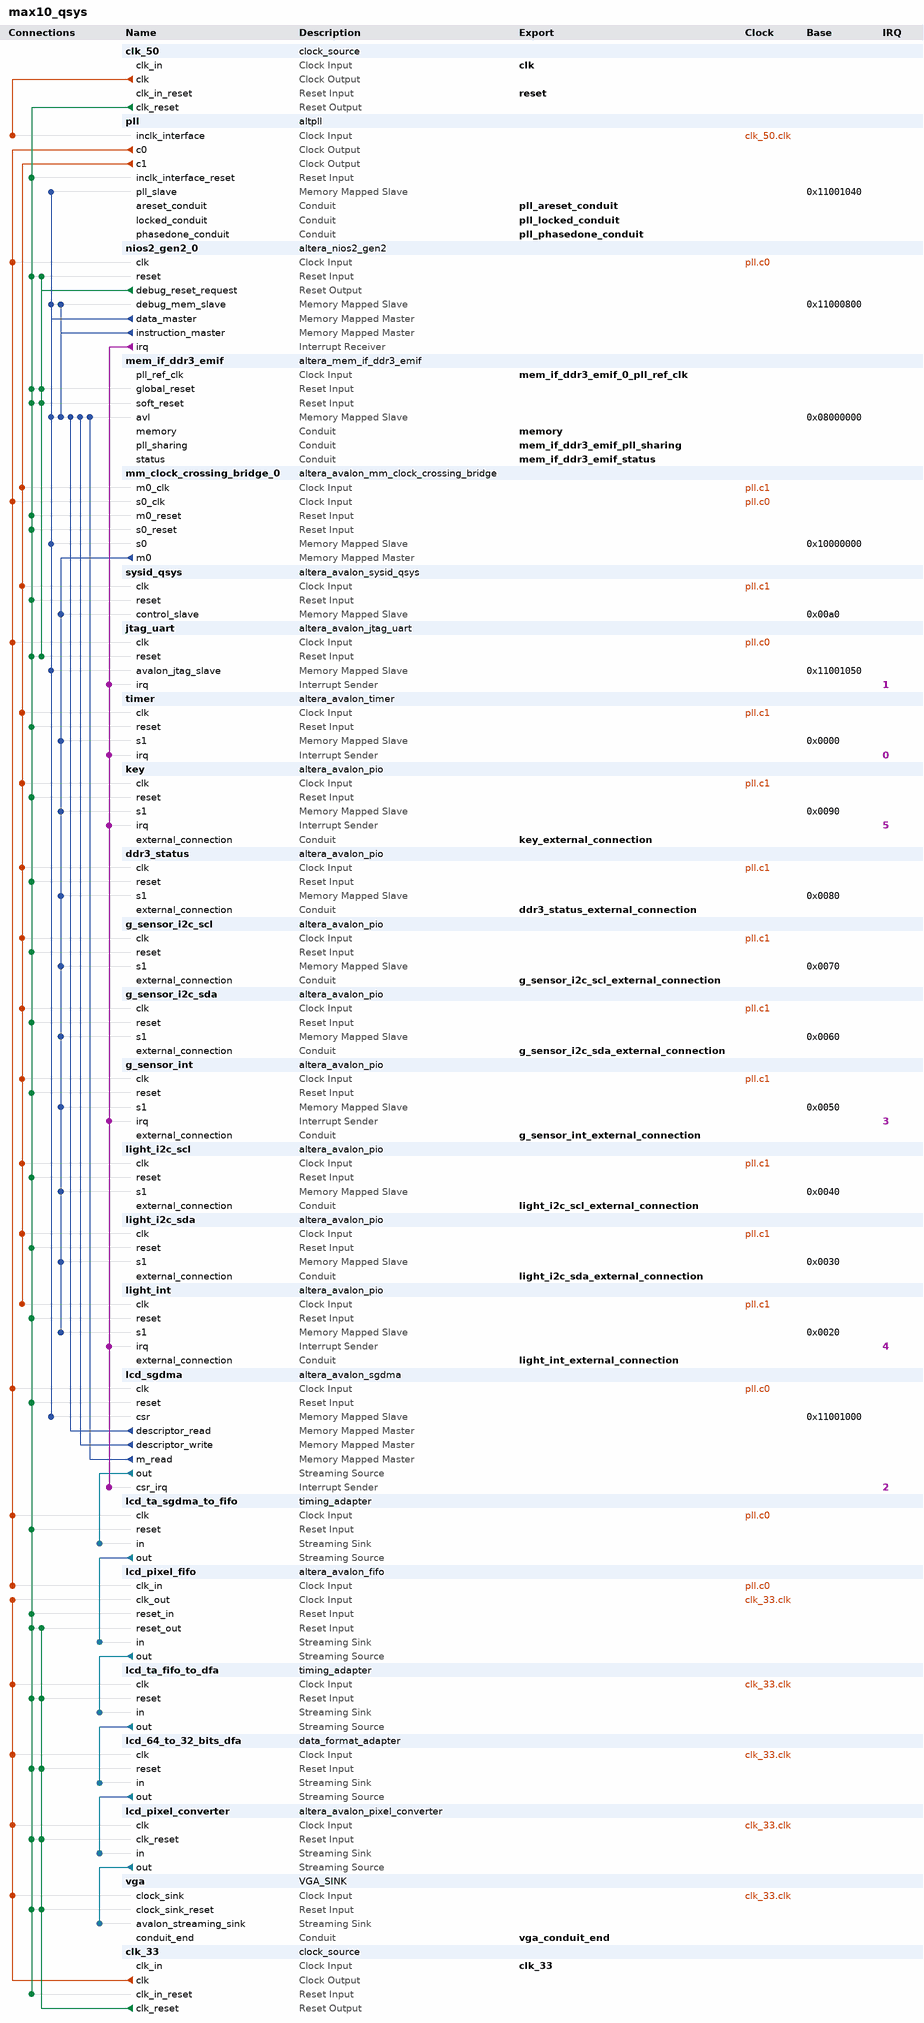
[diagram p0: system contents]
# Platform Designer (Qsys) system max10_qsys, MAX 10 10M50DAF484C6GES
# Parameters at their usual value, and those the tool derives, are not listed.
package require -exact qsys 15.0
create_system max10_qsys
set_project_property DEVICE_FAMILY {MAX 10}
set_project_property DEVICE 10M50DAF484C6GES

add_instance clk_50 clock_source 15.0
set_instance_parameter_value clk_50 clockFrequency 50000000

add_instance pll altpll 15.0
set_instance_parameter_value pll CLK0_DIVIDE_BY 1
set_instance_parameter_value pll CLK0_MULTIPLY_BY 2
set_instance_parameter_value pll CLK1_DIVIDE_BY 5
set_instance_parameter_value pll CLK1_DUTY_CYCLE 50
set_instance_parameter_value pll CLK1_MULTIPLY_BY 4
set_instance_parameter_value pll CLK1_PHASE_SHIFT 0
set_instance_parameter_value pll INCLK0_INPUT_FREQUENCY 20000
set_instance_parameter_value pll PORT_ARESET PORT_USED
set_instance_parameter_value pll PORT_LOCKED PORT_USED
set_instance_parameter_value pll PORT_clk1 PORT_USED
set_instance_parameter_value pll PORT_clk2 PORT_UNUSED
set_instance_parameter_value pll PORT_clk3 PORT_UNUSED

add_instance nios2_gen2_0 altera_nios2_gen2 15.0
set_instance_parameter_value nios2_gen2_0 dcache_size 2048
set_instance_parameter_value nios2_gen2_0 exceptionSlave mem_if_ddr3_emif.avl
set_instance_parameter_value nios2_gen2_0 icache_size 4096
set_instance_parameter_value nios2_gen2_0 impl Fast
set_instance_parameter_value nios2_gen2_0 resetSlave mem_if_ddr3_emif.avl

add_instance mem_if_ddr3_emif altera_mem_if_ddr3_emif 15.0
set_instance_parameter_value mem_if_ddr3_emif AVL_MAX_SIZE 4
set_instance_parameter_value mem_if_ddr3_emif CALIBRATION_MODE Skip
set_instance_parameter_value mem_if_ddr3_emif CPORT_TYPE_PORT Bidirectional,Bidirectional,Bidirectional,Bidirectional,Bidirectional,Bidirectional
set_instance_parameter_value mem_if_ddr3_emif EXPORT_AFI_HALF_CLK false
set_instance_parameter_value mem_if_ddr3_emif HARD_EMIF false
set_instance_parameter_value mem_if_ddr3_emif MEM_BANKADDR_WIDTH 3
set_instance_parameter_value mem_if_ddr3_emif MEM_CLK_FREQ 300.0
set_instance_parameter_value mem_if_ddr3_emif MEM_CLK_FREQ_MAX 800.0
set_instance_parameter_value mem_if_ddr3_emif MEM_COL_ADDR_WIDTH 10
set_instance_parameter_value mem_if_ddr3_emif MEM_DQ_WIDTH 24
set_instance_parameter_value mem_if_ddr3_emif MEM_FORMAT DISCRETE
set_instance_parameter_value mem_if_ddr3_emif MEM_ROW_ADDR_WIDTH 13
set_instance_parameter_value mem_if_ddr3_emif MEM_TCL 7
set_instance_parameter_value mem_if_ddr3_emif MEM_TFAW_NS 45.0
set_instance_parameter_value mem_if_ddr3_emif MEM_TRAS_NS 35.0
set_instance_parameter_value mem_if_ddr3_emif MEM_TRCD_NS 13.75
set_instance_parameter_value mem_if_ddr3_emif MEM_TRFC_NS 260.0
set_instance_parameter_value mem_if_ddr3_emif MEM_TRP_NS 13.75
set_instance_parameter_value mem_if_ddr3_emif MEM_TRRD_NS 7.5
set_instance_parameter_value mem_if_ddr3_emif MEM_TRTP_NS 7.5
set_instance_parameter_value mem_if_ddr3_emif MEM_TWTR 6
set_instance_parameter_value mem_if_ddr3_emif MEM_VENDOR Micron
set_instance_parameter_value mem_if_ddr3_emif MEM_WTCL 6
set_instance_parameter_value mem_if_ddr3_emif PLL_LOCATION Top_Bottom
set_instance_parameter_value mem_if_ddr3_emif POWER_OF_TWO_BUS true
set_instance_parameter_value mem_if_ddr3_emif PRIORITY_PORT 1,1,1,1,1,1
set_instance_parameter_value mem_if_ddr3_emif RATE Half
set_instance_parameter_value mem_if_ddr3_emif REF_CLK_FREQ 50.0
set_instance_parameter_value mem_if_ddr3_emif SPEED_GRADE 6
set_instance_parameter_value mem_if_ddr3_emif TIMING_BOARD_AC_SKEW 0.0116
set_instance_parameter_value mem_if_ddr3_emif TIMING_BOARD_AC_TO_CK_SKEW -0.005
set_instance_parameter_value mem_if_ddr3_emif TIMING_BOARD_DQ_TO_DQS_SKEW -3.0E-4
set_instance_parameter_value mem_if_ddr3_emif TIMING_BOARD_MAX_CK_DELAY 0.314
set_instance_parameter_value mem_if_ddr3_emif TIMING_BOARD_MAX_DQS_DELAY 0.199
set_instance_parameter_value mem_if_ddr3_emif TIMING_BOARD_SKEW_BETWEEN_DQS 0.0267
set_instance_parameter_value mem_if_ddr3_emif TIMING_BOARD_SKEW_CKDQS_DIMM_MAX 0.142
set_instance_parameter_value mem_if_ddr3_emif TIMING_BOARD_SKEW_CKDQS_DIMM_MIN 0.115
set_instance_parameter_value mem_if_ddr3_emif TIMING_BOARD_SKEW_WITHIN_DQS 0.007
set_instance_parameter_value mem_if_ddr3_emif TIMING_TDH 55
set_instance_parameter_value mem_if_ddr3_emif TIMING_TDQSCK 225
set_instance_parameter_value mem_if_ddr3_emif TIMING_TDQSQ 125
set_instance_parameter_value mem_if_ddr3_emif TIMING_TDQSS 0.25
set_instance_parameter_value mem_if_ddr3_emif TIMING_TDS 55
set_instance_parameter_value mem_if_ddr3_emif TIMING_TDSH 0.2
set_instance_parameter_value mem_if_ddr3_emif TIMING_TDSS 0.2
set_instance_parameter_value mem_if_ddr3_emif TIMING_TIH 130
set_instance_parameter_value mem_if_ddr3_emif TIMING_TIS 185
set_instance_parameter_value mem_if_ddr3_emif TIMING_TQSH 0.4
set_instance_parameter_value mem_if_ddr3_emif USER_DEBUG_LEVEL 1

add_instance mm_clock_crossing_bridge_0 altera_avalon_mm_clock_crossing_bridge 15.0
set_instance_parameter_value mm_clock_crossing_bridge_0 ADDRESS_WIDTH 10
set_instance_parameter_value mm_clock_crossing_bridge_0 COMMAND_FIFO_DEPTH 4
set_instance_parameter_value mm_clock_crossing_bridge_0 DATA_WIDTH 32
set_instance_parameter_value mm_clock_crossing_bridge_0 MASTER_SYNC_DEPTH 2
set_instance_parameter_value mm_clock_crossing_bridge_0 MAX_BURST_SIZE 1
set_instance_parameter_value mm_clock_crossing_bridge_0 RESPONSE_FIFO_DEPTH 4
set_instance_parameter_value mm_clock_crossing_bridge_0 SLAVE_SYNC_DEPTH 2
set_instance_parameter_value mm_clock_crossing_bridge_0 USE_AUTO_ADDRESS_WIDTH 0

add_instance sysid_qsys altera_avalon_sysid_qsys 15.0
set_instance_parameter_value sysid_qsys id 0

add_instance jtag_uart altera_avalon_jtag_uart 15.0
set_instance_parameter_value jtag_uart simInteractiveOptions INTERACTIVE_ASCII_OUTPUT

add_instance timer altera_avalon_timer 15.0
set_instance_parameter_value timer period 1
set_instance_parameter_value timer periodUnits MSEC

add_instance key altera_avalon_pio 15.0
set_instance_parameter_value key captureEdge true
set_instance_parameter_value key direction Input
set_instance_parameter_value key edgeType FALLING
set_instance_parameter_value key generateIRQ true
set_instance_parameter_value key irqType EDGE
set_instance_parameter_value key width 5

add_instance ddr3_status altera_avalon_pio 15.0
set_instance_parameter_value ddr3_status direction Input
set_instance_parameter_value ddr3_status width 3

add_instance g_sensor_i2c_scl altera_avalon_pio 15.0
set_instance_parameter_value g_sensor_i2c_scl direction Output
set_instance_parameter_value g_sensor_i2c_scl width 1

add_instance g_sensor_i2c_sda altera_avalon_pio 15.0
set_instance_parameter_value g_sensor_i2c_sda direction Bidir
set_instance_parameter_value g_sensor_i2c_sda width 1

add_instance g_sensor_int altera_avalon_pio 15.0
set_instance_parameter_value g_sensor_int captureEdge true
set_instance_parameter_value g_sensor_int direction Input
set_instance_parameter_value g_sensor_int edgeType FALLING
set_instance_parameter_value g_sensor_int generateIRQ true
set_instance_parameter_value g_sensor_int irqType EDGE
set_instance_parameter_value g_sensor_int width 2

add_instance light_i2c_scl altera_avalon_pio 15.0
set_instance_parameter_value light_i2c_scl direction Output
set_instance_parameter_value light_i2c_scl width 1

add_instance light_i2c_sda altera_avalon_pio 15.0
set_instance_parameter_value light_i2c_sda direction Bidir
set_instance_parameter_value light_i2c_sda width 1

add_instance light_int altera_avalon_pio 15.0
set_instance_parameter_value light_int captureEdge true
set_instance_parameter_value light_int direction Input
set_instance_parameter_value light_int edgeType FALLING
set_instance_parameter_value light_int generateIRQ true
set_instance_parameter_value light_int irqType EDGE
set_instance_parameter_value light_int width 1

add_instance lcd_sgdma altera_avalon_sgdma 15.0
set_instance_parameter_value lcd_sgdma enableBurstTransfers true
set_instance_parameter_value lcd_sgdma enableUnalignedTransfers false
set_instance_parameter_value lcd_sgdma readBlockDataWidth 64
set_instance_parameter_value lcd_sgdma readBurstcountWidth 8
set_instance_parameter_value lcd_sgdma sinkErrorWidth 0
set_instance_parameter_value lcd_sgdma sourceErrorWidth 0
set_instance_parameter_value lcd_sgdma transferMode MEMORY_TO_STREAM
set_instance_parameter_value lcd_sgdma writeBurstcountWidth 4

add_instance lcd_ta_sgdma_to_fifo timing_adapter 15.0
set_instance_parameter_value lcd_ta_sgdma_to_fifo inBitsPerSymbol 8
set_instance_parameter_value lcd_ta_sgdma_to_fifo inChannelWidth 0
set_instance_parameter_value lcd_ta_sgdma_to_fifo inErrorWidth 0
set_instance_parameter_value lcd_ta_sgdma_to_fifo inMaxChannel 0
set_instance_parameter_value lcd_ta_sgdma_to_fifo inReadyLatency 0
set_instance_parameter_value lcd_ta_sgdma_to_fifo inSymbolsPerBeat 8
set_instance_parameter_value lcd_ta_sgdma_to_fifo inUseEmptyPort AUTO
set_instance_parameter_value lcd_ta_sgdma_to_fifo inUsePackets true
set_instance_parameter_value lcd_ta_sgdma_to_fifo inUseReady true
set_instance_parameter_value lcd_ta_sgdma_to_fifo inUseValid true
set_instance_parameter_value lcd_ta_sgdma_to_fifo outReadyLatency 1
set_instance_parameter_value lcd_ta_sgdma_to_fifo outUseReady true
set_instance_parameter_value lcd_ta_sgdma_to_fifo outUseValid true

add_instance lcd_pixel_fifo altera_avalon_fifo 15.0
set_instance_parameter_value lcd_pixel_fifo bitsPerSymbol 8
set_instance_parameter_value lcd_pixel_fifo channelWidth 0
set_instance_parameter_value lcd_pixel_fifo errorWidth 0
set_instance_parameter_value lcd_pixel_fifo fifoDepth 128
set_instance_parameter_value lcd_pixel_fifo fifoInputInterfaceOptions AVALONST_SINK
set_instance_parameter_value lcd_pixel_fifo fifoOutputInterfaceOptions AVALONST_SOURCE
set_instance_parameter_value lcd_pixel_fifo singleClockMode false
set_instance_parameter_value lcd_pixel_fifo symbolsPerBeat 8
set_instance_parameter_value lcd_pixel_fifo useIRQ true
set_instance_parameter_value lcd_pixel_fifo usePacket true
set_instance_parameter_value lcd_pixel_fifo useReadControl false
set_instance_parameter_value lcd_pixel_fifo useWriteControl false

add_instance lcd_ta_fifo_to_dfa timing_adapter 15.0
set_instance_parameter_value lcd_ta_fifo_to_dfa inBitsPerSymbol 8
set_instance_parameter_value lcd_ta_fifo_to_dfa inChannelWidth 0
set_instance_parameter_value lcd_ta_fifo_to_dfa inErrorWidth 0
set_instance_parameter_value lcd_ta_fifo_to_dfa inMaxChannel 0
set_instance_parameter_value lcd_ta_fifo_to_dfa inReadyLatency 1
set_instance_parameter_value lcd_ta_fifo_to_dfa inSymbolsPerBeat 8
set_instance_parameter_value lcd_ta_fifo_to_dfa inUseEmptyPort AUTO
set_instance_parameter_value lcd_ta_fifo_to_dfa inUsePackets true
set_instance_parameter_value lcd_ta_fifo_to_dfa inUseReady true
set_instance_parameter_value lcd_ta_fifo_to_dfa inUseValid true
set_instance_parameter_value lcd_ta_fifo_to_dfa outReadyLatency 0
set_instance_parameter_value lcd_ta_fifo_to_dfa outUseReady true
set_instance_parameter_value lcd_ta_fifo_to_dfa outUseValid true

add_instance lcd_64_to_32_bits_dfa data_format_adapter 15.0
set_instance_parameter_value lcd_64_to_32_bits_dfa inBitsPerSymbol 8
set_instance_parameter_value lcd_64_to_32_bits_dfa inChannelWidth 0
set_instance_parameter_value lcd_64_to_32_bits_dfa inErrorWidth 0
set_instance_parameter_value lcd_64_to_32_bits_dfa inMaxChannel 0
set_instance_parameter_value lcd_64_to_32_bits_dfa inReadyLatency 0
set_instance_parameter_value lcd_64_to_32_bits_dfa inSymbolsPerBeat 8
set_instance_parameter_value lcd_64_to_32_bits_dfa inUseEmpty false
set_instance_parameter_value lcd_64_to_32_bits_dfa inUseEmptyPort AUTO
set_instance_parameter_value lcd_64_to_32_bits_dfa inUsePackets true
set_instance_parameter_value lcd_64_to_32_bits_dfa outSymbolsPerBeat 4
set_instance_parameter_value lcd_64_to_32_bits_dfa outUseEmpty false
set_instance_parameter_value lcd_64_to_32_bits_dfa outUseEmptyPort AUTO

add_instance lcd_pixel_converter altera_avalon_pixel_converter 15.0
set_instance_parameter_value lcd_pixel_converter SOURCE_SYMBOLS_PER_BEAT 1

add_instance vga VGA_SINK 1.0
set_instance_parameter_value vga BITS_PER_SYMBOL 24
set_instance_parameter_value vga H_BPORCH 16
set_instance_parameter_value vga H_DISP 800
set_instance_parameter_value vga H_FPORCH 210
set_instance_parameter_value vga H_SYNC 30
set_instance_parameter_value vga MAX_CHANNEL 0
set_instance_parameter_value vga READY_LATENCY 0
set_instance_parameter_value vga SYMBOLS_PER_BEAT 1
set_instance_parameter_value vga V_BPORCH 10
set_instance_parameter_value vga V_DISP 480
set_instance_parameter_value vga V_FPORCH 22
set_instance_parameter_value vga V_SYNC 13

add_instance clk_33 clock_source 15.0
set_instance_parameter_value clk_33 clockFrequency 33000000

# connections
add_connection clk_33.clk lcd_64_to_32_bits_dfa.clk clock
add_connection clk_33.clk lcd_pixel_converter.clk clock
add_connection clk_33.clk lcd_pixel_fifo.clk_out clock
add_connection clk_33.clk lcd_ta_fifo_to_dfa.clk clock
add_connection clk_33.clk vga.clock_sink clock
add_connection clk_50.clk pll.inclk_interface clock
add_connection pll.c0 jtag_uart.clk clock
add_connection pll.c0 lcd_pixel_fifo.clk_in clock
add_connection pll.c0 lcd_sgdma.clk clock
add_connection pll.c0 lcd_ta_sgdma_to_fifo.clk clock
add_connection pll.c0 mm_clock_crossing_bridge_0.s0_clk clock
add_connection pll.c0 nios2_gen2_0.clk clock
add_connection pll.c1 ddr3_status.clk clock
add_connection pll.c1 g_sensor_i2c_scl.clk clock
add_connection pll.c1 g_sensor_i2c_sda.clk clock
add_connection pll.c1 g_sensor_int.clk clock
add_connection pll.c1 key.clk clock
add_connection pll.c1 light_i2c_scl.clk clock
add_connection pll.c1 light_i2c_sda.clk clock
add_connection pll.c1 light_int.clk clock
add_connection pll.c1 mm_clock_crossing_bridge_0.m0_clk clock
add_connection pll.c1 sysid_qsys.clk clock
add_connection pll.c1 timer.clk clock
add_connection clk_33.clk_reset lcd_64_to_32_bits_dfa.reset reset
add_connection clk_33.clk_reset lcd_pixel_converter.clk_reset reset
add_connection clk_33.clk_reset lcd_pixel_fifo.reset_out reset
add_connection clk_33.clk_reset lcd_ta_fifo_to_dfa.reset reset
add_connection clk_33.clk_reset vga.clock_sink_reset reset
add_connection clk_50.clk_reset clk_33.clk_in_reset reset
add_connection clk_50.clk_reset ddr3_status.reset reset
add_connection clk_50.clk_reset g_sensor_i2c_scl.reset reset
add_connection clk_50.clk_reset g_sensor_i2c_sda.reset reset
add_connection clk_50.clk_reset g_sensor_int.reset reset
add_connection clk_50.clk_reset jtag_uart.reset reset
add_connection clk_50.clk_reset key.reset reset
add_connection clk_50.clk_reset lcd_64_to_32_bits_dfa.reset reset
add_connection clk_50.clk_reset lcd_pixel_converter.clk_reset reset
add_connection clk_50.clk_reset lcd_pixel_fifo.reset_in reset
add_connection clk_50.clk_reset lcd_pixel_fifo.reset_out reset
add_connection clk_50.clk_reset lcd_sgdma.reset reset
add_connection clk_50.clk_reset lcd_ta_fifo_to_dfa.reset reset
add_connection clk_50.clk_reset lcd_ta_sgdma_to_fifo.reset reset
add_connection clk_50.clk_reset light_i2c_scl.reset reset
add_connection clk_50.clk_reset light_i2c_sda.reset reset
add_connection clk_50.clk_reset light_int.reset reset
add_connection clk_50.clk_reset mem_if_ddr3_emif.global_reset reset
add_connection clk_50.clk_reset mem_if_ddr3_emif.soft_reset reset
add_connection clk_50.clk_reset mm_clock_crossing_bridge_0.m0_reset reset
add_connection clk_50.clk_reset mm_clock_crossing_bridge_0.s0_reset reset
add_connection clk_50.clk_reset nios2_gen2_0.reset reset
add_connection clk_50.clk_reset pll.inclk_interface_reset reset
add_connection clk_50.clk_reset sysid_qsys.reset reset
add_connection clk_50.clk_reset timer.reset reset
add_connection clk_50.clk_reset vga.clock_sink_reset reset
add_connection nios2_gen2_0.debug_reset_request jtag_uart.reset reset
add_connection nios2_gen2_0.debug_reset_request mem_if_ddr3_emif.global_reset reset
add_connection nios2_gen2_0.debug_reset_request mem_if_ddr3_emif.soft_reset reset
add_connection nios2_gen2_0.debug_reset_request nios2_gen2_0.reset reset
add_connection lcd_sgdma.descriptor_read mem_if_ddr3_emif.avl avalon
set_connection_parameter_value lcd_sgdma.descriptor_read/mem_if_ddr3_emif.avl baseAddress 0x08000000
add_connection lcd_sgdma.descriptor_write mem_if_ddr3_emif.avl avalon
set_connection_parameter_value lcd_sgdma.descriptor_write/mem_if_ddr3_emif.avl baseAddress 0x08000000
add_connection lcd_sgdma.m_read mem_if_ddr3_emif.avl avalon
set_connection_parameter_value lcd_sgdma.m_read/mem_if_ddr3_emif.avl baseAddress 0x08000000
add_connection mm_clock_crossing_bridge_0.m0 ddr3_status.s1 avalon
set_connection_parameter_value mm_clock_crossing_bridge_0.m0/ddr3_status.s1 baseAddress 0x0080
add_connection mm_clock_crossing_bridge_0.m0 g_sensor_i2c_scl.s1 avalon
set_connection_parameter_value mm_clock_crossing_bridge_0.m0/g_sensor_i2c_scl.s1 baseAddress 0x0070
add_connection mm_clock_crossing_bridge_0.m0 g_sensor_i2c_sda.s1 avalon
set_connection_parameter_value mm_clock_crossing_bridge_0.m0/g_sensor_i2c_sda.s1 baseAddress 0x0060
add_connection mm_clock_crossing_bridge_0.m0 g_sensor_int.s1 avalon
set_connection_parameter_value mm_clock_crossing_bridge_0.m0/g_sensor_int.s1 baseAddress 0x0050
add_connection mm_clock_crossing_bridge_0.m0 key.s1 avalon
set_connection_parameter_value mm_clock_crossing_bridge_0.m0/key.s1 baseAddress 0x0090
add_connection mm_clock_crossing_bridge_0.m0 light_i2c_scl.s1 avalon
set_connection_parameter_value mm_clock_crossing_bridge_0.m0/light_i2c_scl.s1 baseAddress 0x0040
add_connection mm_clock_crossing_bridge_0.m0 light_i2c_sda.s1 avalon
set_connection_parameter_value mm_clock_crossing_bridge_0.m0/light_i2c_sda.s1 baseAddress 0x0030
add_connection mm_clock_crossing_bridge_0.m0 light_int.s1 avalon
set_connection_parameter_value mm_clock_crossing_bridge_0.m0/light_int.s1 baseAddress 0x0020
add_connection mm_clock_crossing_bridge_0.m0 sysid_qsys.control_slave avalon
set_connection_parameter_value mm_clock_crossing_bridge_0.m0/sysid_qsys.control_slave baseAddress 0x00a0
add_connection mm_clock_crossing_bridge_0.m0 timer.s1 avalon
set_connection_parameter_value mm_clock_crossing_bridge_0.m0/timer.s1 baseAddress 0x0000
add_connection nios2_gen2_0.data_master jtag_uart.avalon_jtag_slave avalon
set_connection_parameter_value nios2_gen2_0.data_master/jtag_uart.avalon_jtag_slave baseAddress 0x11001050
add_connection nios2_gen2_0.data_master lcd_sgdma.csr avalon
set_connection_parameter_value nios2_gen2_0.data_master/lcd_sgdma.csr baseAddress 0x11001000
add_connection nios2_gen2_0.data_master mem_if_ddr3_emif.avl avalon
set_connection_parameter_value nios2_gen2_0.data_master/mem_if_ddr3_emif.avl baseAddress 0x08000000
add_connection nios2_gen2_0.data_master mm_clock_crossing_bridge_0.s0 avalon
set_connection_parameter_value nios2_gen2_0.data_master/mm_clock_crossing_bridge_0.s0 baseAddress 0x10000000
add_connection nios2_gen2_0.data_master nios2_gen2_0.debug_mem_slave avalon
set_connection_parameter_value nios2_gen2_0.data_master/nios2_gen2_0.debug_mem_slave baseAddress 0x11000800
add_connection nios2_gen2_0.data_master pll.pll_slave avalon
set_connection_parameter_value nios2_gen2_0.data_master/pll.pll_slave baseAddress 0x11001040
add_connection nios2_gen2_0.instruction_master mem_if_ddr3_emif.avl avalon
set_connection_parameter_value nios2_gen2_0.instruction_master/mem_if_ddr3_emif.avl baseAddress 0x08000000
add_connection nios2_gen2_0.instruction_master nios2_gen2_0.debug_mem_slave avalon
set_connection_parameter_value nios2_gen2_0.instruction_master/nios2_gen2_0.debug_mem_slave baseAddress 0x11000800
add_connection lcd_64_to_32_bits_dfa.out lcd_pixel_converter.in avalon_streaming
add_connection lcd_pixel_converter.out vga.avalon_streaming_sink avalon_streaming
add_connection lcd_pixel_fifo.out lcd_ta_fifo_to_dfa.in avalon_streaming
add_connection lcd_sgdma.out lcd_ta_sgdma_to_fifo.in avalon_streaming
add_connection lcd_ta_fifo_to_dfa.out lcd_64_to_32_bits_dfa.in avalon_streaming
add_connection lcd_ta_sgdma_to_fifo.out lcd_pixel_fifo.in avalon_streaming
add_connection nios2_gen2_0.irq g_sensor_int.irq interrupt
set_connection_parameter_value nios2_gen2_0.irq/g_sensor_int.irq irqNumber 3
add_connection nios2_gen2_0.irq jtag_uart.irq interrupt
set_connection_parameter_value nios2_gen2_0.irq/jtag_uart.irq irqNumber 1
add_connection nios2_gen2_0.irq key.irq interrupt
set_connection_parameter_value nios2_gen2_0.irq/key.irq irqNumber 5
add_connection nios2_gen2_0.irq lcd_sgdma.csr_irq interrupt
set_connection_parameter_value nios2_gen2_0.irq/lcd_sgdma.csr_irq irqNumber 2
add_connection nios2_gen2_0.irq light_int.irq interrupt
set_connection_parameter_value nios2_gen2_0.irq/light_int.irq irqNumber 4
add_connection nios2_gen2_0.irq timer.irq interrupt
set_connection_parameter_value nios2_gen2_0.irq/timer.irq irqNumber 0

# exported interfaces
add_interface clk clock sink
set_interface_property clk EXPORT_OF clk_50.clk_in
add_interface clk_33 clock sink
set_interface_property clk_33 EXPORT_OF clk_33.clk_in
add_interface ddr3_status_external_connection conduit end
set_interface_property ddr3_status_external_connection EXPORT_OF ddr3_status.external_connection
add_interface g_sensor_i2c_scl_external_connection conduit end
set_interface_property g_sensor_i2c_scl_external_connection EXPORT_OF g_sensor_i2c_scl.external_connection
add_interface g_sensor_i2c_sda_external_connection conduit end
set_interface_property g_sensor_i2c_sda_external_connection EXPORT_OF g_sensor_i2c_sda.external_connection
add_interface g_sensor_int_external_connection conduit end
set_interface_property g_sensor_int_external_connection EXPORT_OF g_sensor_int.external_connection
add_interface key_external_connection conduit end
set_interface_property key_external_connection EXPORT_OF key.external_connection
add_interface light_i2c_scl_external_connection conduit end
set_interface_property light_i2c_scl_external_connection EXPORT_OF light_i2c_scl.external_connection
add_interface light_i2c_sda_external_connection conduit end
set_interface_property light_i2c_sda_external_connection EXPORT_OF light_i2c_sda.external_connection
add_interface light_int_external_connection conduit end
set_interface_property light_int_external_connection EXPORT_OF light_int.external_connection
add_interface mem_if_ddr3_emif_0_pll_ref_clk clock sink
set_interface_property mem_if_ddr3_emif_0_pll_ref_clk EXPORT_OF mem_if_ddr3_emif.pll_ref_clk
add_interface mem_if_ddr3_emif_pll_sharing conduit end
set_interface_property mem_if_ddr3_emif_pll_sharing EXPORT_OF mem_if_ddr3_emif.pll_sharing
add_interface mem_if_ddr3_emif_status conduit end
set_interface_property mem_if_ddr3_emif_status EXPORT_OF mem_if_ddr3_emif.status
add_interface memory conduit end
set_interface_property memory EXPORT_OF mem_if_ddr3_emif.memory
add_interface pll_areset_conduit conduit end
set_interface_property pll_areset_conduit EXPORT_OF pll.areset_conduit
add_interface pll_locked_conduit conduit end
set_interface_property pll_locked_conduit EXPORT_OF pll.locked_conduit
add_interface pll_phasedone_conduit conduit end
set_interface_property pll_phasedone_conduit EXPORT_OF pll.phasedone_conduit
add_interface reset reset sink
set_interface_property reset EXPORT_OF clk_50.clk_in_reset
add_interface vga_conduit_end conduit end
set_interface_property vga_conduit_end EXPORT_OF vga.conduit_end

set_interconnect_requirement {$system} qsys_mm.clockCrossingAdapter HANDSHAKE
set_interconnect_requirement {$system} qsys_mm.maxAdditionalLatency 1

save_system max10_qsys.qsys
